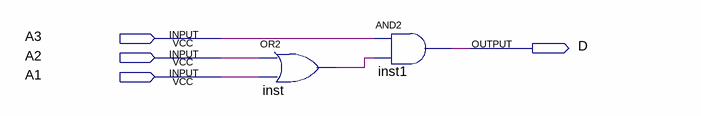
[diagram p0: schematic sheet]
// Quartus schematic detector_10.bdf as structural Verilog: 2 symbols, 4 pins
module detector_10 (
  input  A3,
  input  A2,
  input  A1,
  output D
);

  wire inst_out;

  or inst (inst_out, A2, A1);
  and inst1 (D, A3, inst_out);
endmodule
